# EAGLE schematic Receiver SMD (EAGLE 6.4)
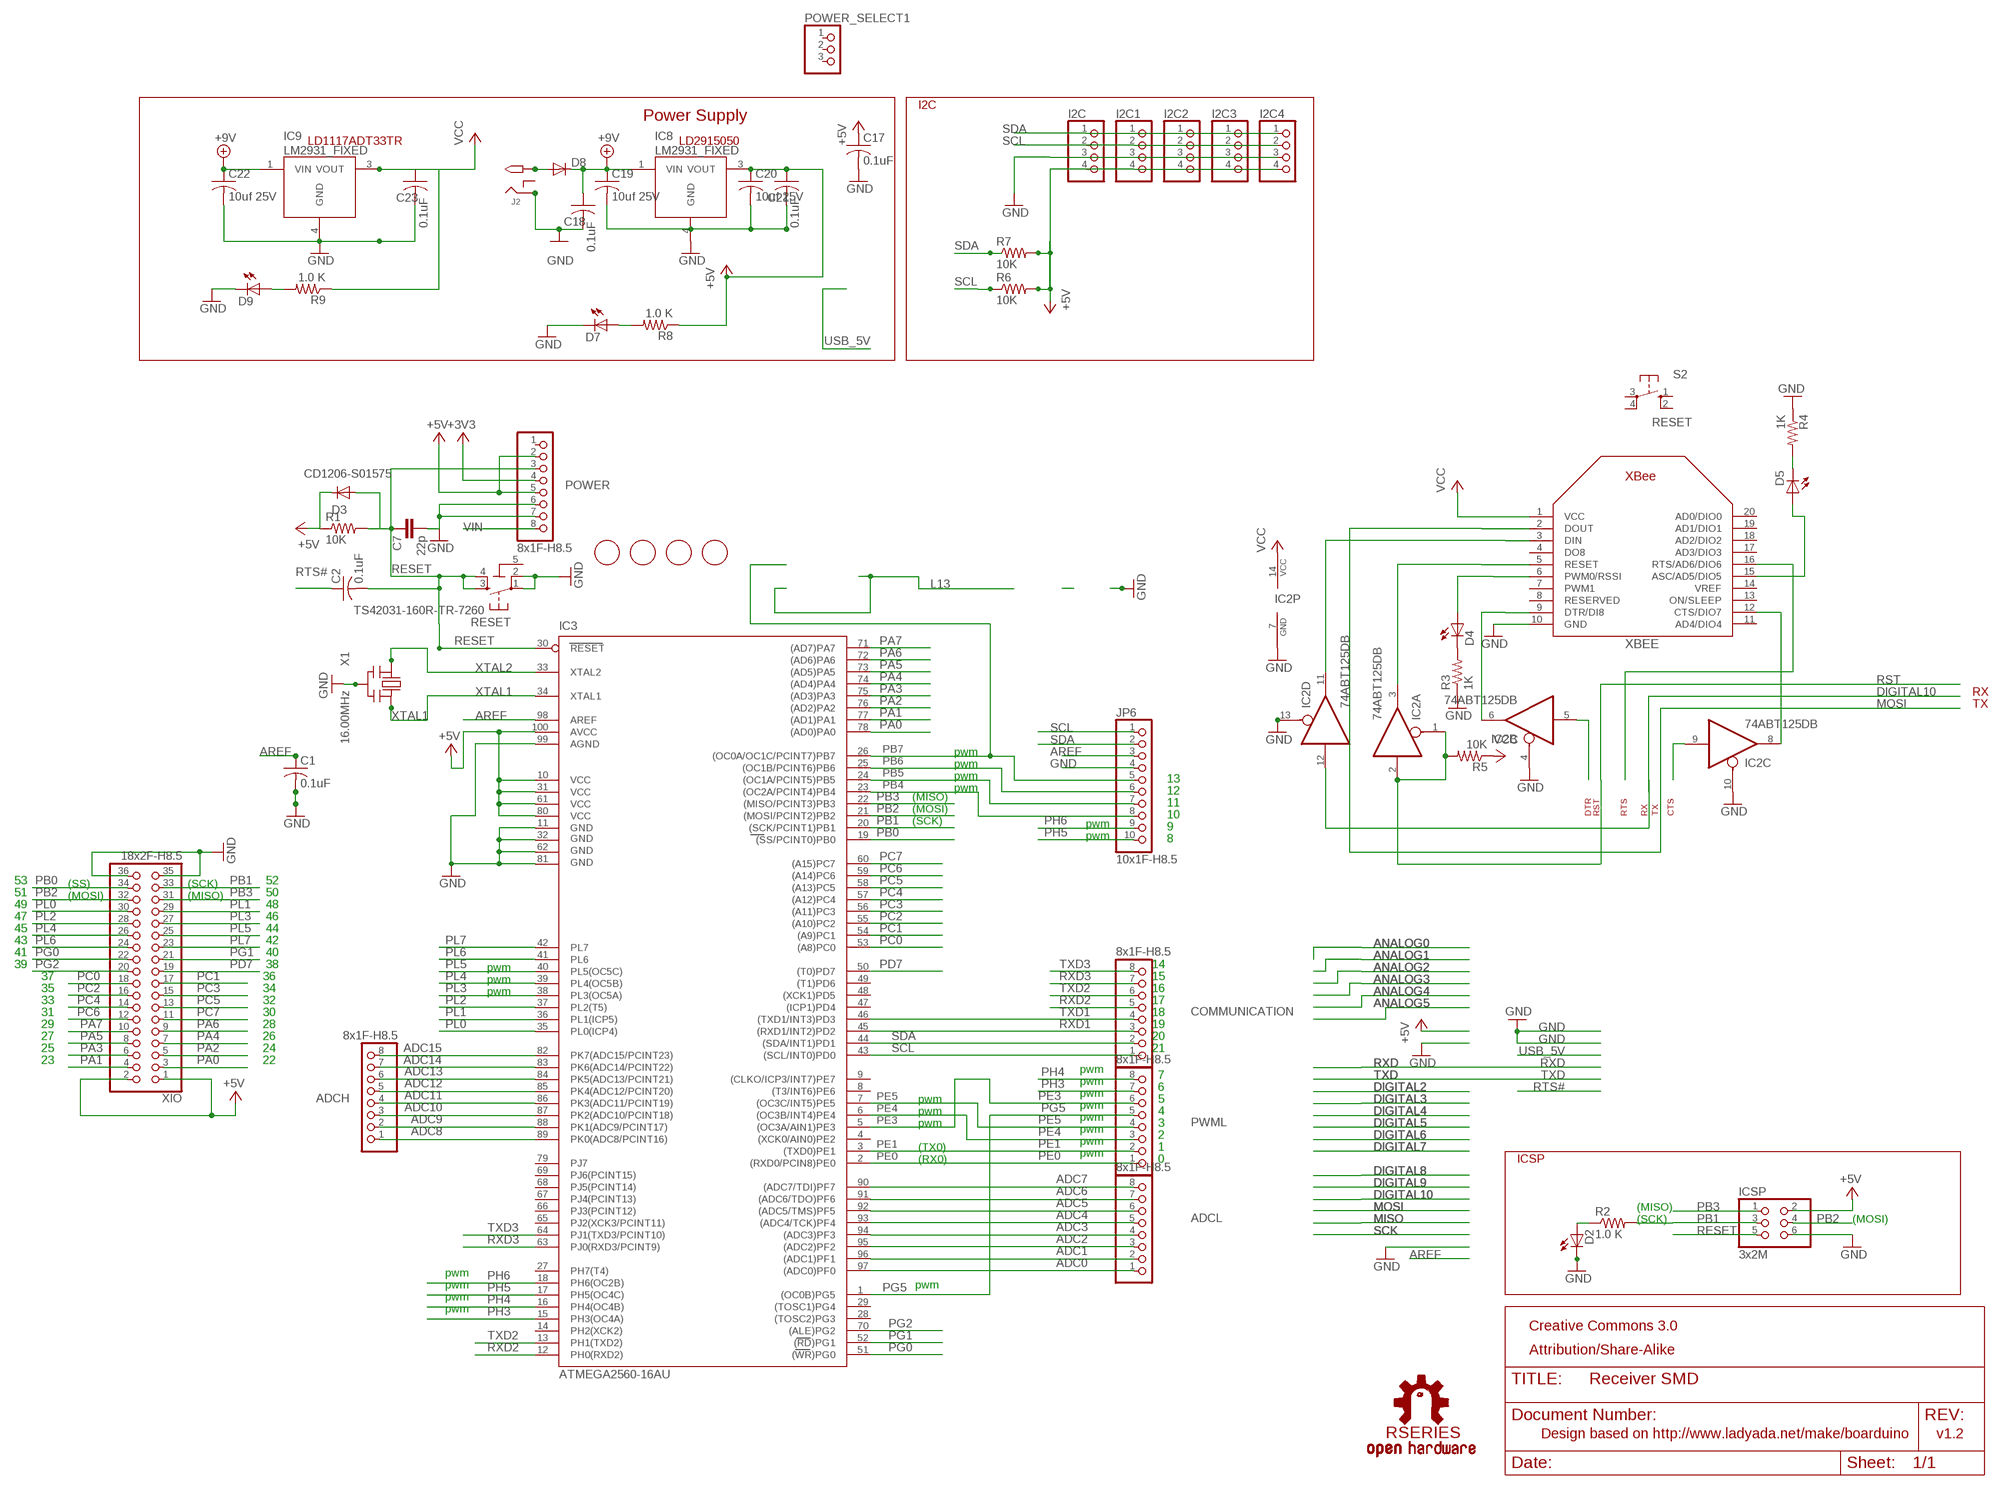
[diagram p0: schematic, sheet 1]

## Parts
ADCH  8x1F-H8.5  PINHD-1X8  [1X08]
ADCL  8x1F-H8.5  PINHD-1X8  [1X08]
C1  0.1uF  C-USC1206K  [C1206K]
C2  0.1uF  C-USC1206K  [C1206K]
C7  22p  C-EU0603-RND  [C0603-ROUND]
C17  0.1uF  C-USC1206K  [C1206K]
C18  0.1uF  C-USC1206K  [C1206K]
C19  10uf 25V  C-USC1206K  [C1206K]
C20  10uf 25V  C-USC1206K  [C1206K]
C21  0.1uF  C-USC1206K  [C1206K]
C22  10uf 25V  C-USC1206K  [C1206K]
C23  0.1uF  C-USC1206K  [C1206K]
COMMUNICATION  8x1F-H8.5  PINHD-1X8  [1X08]
D2  RED  LEDCHIPLED_1206  [CHIPLED_1206]
D3  CD1206-S01575  DIODE-MINIMELF  [MINIMELF]
D4  LEDCHIPLED_1206  [CHIPLED_1206]
D5  LEDCHIPLED_1206  [CHIPLED_1206]
D7  LEDCHIPLED_1206  [CHIPLED_1206]
D8  DIODE-SMB  [SMB]
D9  LEDCHIPLED_1206  [CHIPLED_1206]
FD1  FIDUCIALMOUNT  [FIDUCIA-MOUNT]
FD2  FIDUCIALMOUNT  [FIDUCIA-MOUNT]
FD3  FIDUCIALMOUNT  [FIDUCIA-MOUNT]
FD4  FIDUCIALMOUNT  [FIDUCIA-MOUNT]
I2C  PINHD-1X4CB  [1X04-CB]
I2C1  PINHD-1X4CB  [1X04-CB]
I2C2  PINHD-1X4CB  [1X04-CB]
I2C3  PINHD-1X4CB  [1X04-CB]
I2C4  PINHD-1X4CB  [1X04-CB]
IC2  74ABT125DB  [SSOP14]
IC3  ATMEGA2560-16AU  ATMEGA25602560-16AU  [TQFP100]
IC8  LM2931_FIXED  [DPAK]
IC9  LM2931_FIXED  [DPAK]
ICSP  3x2M  PINHD-2X3  [2X03]
J2  2.1MMJACK  [PJ-102A]
JP6  10x1F-H8.5  PINHD-1X10_ARD  [1X10]
POWER  8x1F-H8.5  PINHD-1X8  [1X08]
POWER_SELECT1  PINHD-1X3  [1X03]
PWML  8x1F-H8.5  PINHD-1X8  [1X08]
R1  10K  R-US_R1206  [R1206]
R2  1.0 K  R-US_M1206  [M1206]
R3  1K  R-US_R1206  [R1206]
R4  1K  R-US_R1206  [R1206]
R5  10K  R-US_R1206  [R1206]
R6  10K  R-US_R1206  [R1206]
R7  10K  R-US_R1206  [R1206]
R8  1.0 K  R-US_M1206  [M1206]
R9  1.0 K  R-US_M1206  [M1206]
RESET  TS42031-160R-TR-7260  TS42  [TS42]
S2  RESET  10-XX  [B3F-10XX]
U$6  RSERIES-OSHW-LOGOMEDIUM  [RSERIES-OSHW-LOGO-MEDIUM]
X1  16.00MHz  CERMOSCILL  [CERM_OSC]
XBEE  XBEE  [XBEE]
XIO  18x2F-H8.5  PINHD-2X18  [2X18]

## Nets
+3V3 [supply]: POWER.4
+5V [power usb]: C17.1 C20.1 C21.1 D3.C I2C1.4 I2C2.4 I2C3.4 I2C4.4 I2C.4 IC3.10(VCC) IC3.31(VCC1) IC3.61(VCC2) IC3.80(VCC3) IC3.100(AVCC) IC8.3(VOUT) ICSP.2 POWER.2 POWER.5 R1.1 R6.2 R7.2 R8.1 XIO.1 XIO.2
+9V [supply]: C18.1 C19.1 C22.1 D8.C IC8.1(VIN) IC9.1(VIN)
ADC0: ADCL.1 IC3.97((ADC0)PF0)
ADC1: ADCL.2 IC3.96((ADC1)PF1)
ADC2: ADCL.3 IC3.95((ADC2)PF2)
ADC3: ADCL.4 IC3.94((ADC3)PF3)
ADC4: ADCL.5 IC3.93((ADC4/TCK)PF4)
ADC5: ADCL.6 IC3.92((ADC5/TMS)PF5)
ADC6: ADCL.7 IC3.91((ADC6/TDO)PF6)
ADC7: ADCL.8 IC3.90((ADC7/TDI)PF7)
ADC8: ADCH.1 IC3.89(PK0(ADC8/PCINT16))
ADC9: ADCH.2 IC3.88(PK1(ADC9/PCINT17))
ADC10: ADCH.3 IC3.87(PK2(ADC10/PCINT18))
ADC11: ADCH.4 IC3.86(PK3(ADC11/PCINT19))
ADC12: ADCH.5 IC3.85(PK4(ADC12/PCINT20))
ADC13: ADCH.6 IC3.84(PK5(ADC13/PCINT21))
ADC14: ADCH.7 IC3.83(PK6(ADC14/PCINT22))
ADC15: ADCH.8 IC3.82(PK7(ADC15/PCINT23))
AREF: C1.1 IC3.98(AREF) JP6.3
DIGITAL10: IC2.12(D:I)
GND [GND]: C1.2 C7.2 C17.2 C18.2 C22.2 C23.2 D2.C D7.C D9.C I2C1.3 I2C2.3 I2C3.3 I2C4.3 I2C.3 IC2.4(B:OE) IC2.7(P:GND) IC2.10(C:OE) IC2.13(D:OE) IC3.11(GND) IC3.32(GND1) IC3.62(GND2) IC3.81(GND3) IC3.99(AGND) IC8.4(GND) IC9.4(GND) ICSP.6 J2.RING JP6.4 POWER.6 POWER.7 R3.1 R4.1 RESET.1 RESET.2 X1.P$2(GND) XBEE.10(GND) XIO.35 XIO.36
MOSI: XBEE.2(DOUT)
N$4: IC2.11(D:O) XBEE.3(DIN)
N$5: D5.C R4.2
N$6: IC2.5(B:I)
N$7: D4.A XBEE.6(PWM0/RSSI)
N$8: D4.C R3.2
N$9: D9.A R9.2
N$10: IC2.6(B:O) XBEE.9(DTR/DI8)
N$11: D2.A R2.1
N$13: IC2.3(A:O) XBEE.5(RESET)
N$21: IC2.9(C:I)
N$22: IC2.8(C:O) XBEE.12(CTS/DIO7)
N$23: D5.A XBEE.15(ASC/AD5/DIO5)
N$28 [supply]: D7.A R8.2
N$29 [supply]: D8.A J2.TIP
N$30: C19.2 C20.2 C21.2
PA0: IC3.78((AD0)PA0) XIO.3
PA1: IC3.77((AD1)PA1) XIO.4
PA2: IC3.76((AD2)PA2) XIO.5
PA3: IC3.75((AD3)PA3) XIO.6
PA4: IC3.74((AD4)PA4) XIO.7
PA5: IC3.73((AD5)PA5) XIO.8
PA6: IC3.72((AD6)PA6) XIO.9
PA7: IC3.71((AD7)PA7) XIO.10
PB0: IC3.19((SS/PCINT0)PB0) XIO.34
PB1: IC3.20((SCK/PCINT1)PB1) ICSP.3 R2.2 XIO.33
PB2: IC3.21((MOSI/PCINT2)PB2) ICSP.4 XIO.32
PB3: IC3.22((MISO/PCINT3)PB3) ICSP.1 XIO.31
PB4: IC3.23((OC2A/PCINT4)PB4) JP6.8
PB5: IC3.24((OC1A/PCINT5)PB5) JP6.7
PB6: IC3.25((OC1B/PCINT6)PB6) JP6.6
PB7: IC3.26((OC0A/OC1C/PCINT7)PB7) JP6.5
PC0: IC3.53((A8)PC0) XIO.18
PC1: IC3.54((A9)PC1) XIO.17
PC2: IC3.55((A10)PC2) XIO.16
PC3: IC3.56((A11)PC3) XIO.15
PC4: IC3.57((A12)PC4) XIO.14
PC5: IC3.58((A13)PC5) XIO.13
PC6: IC3.59((A14)PC6) XIO.12
PC7: IC3.60((A15)PC7) XIO.11
PD7: IC3.50((T0)PD7) XIO.19
PE0: IC3.2((RXD0/PCIN8)PE0) PWML.1
PE1: IC3.3((TXD0)PE1) PWML.2
PE3: IC3.5((OC3A/AIN1)PE3) PWML.6
PE4: IC3.6((OC3B/INT4)PE4) PWML.3
PE5: IC3.7((OC3C/INT5)PE5) PWML.4
PG0: IC3.51((WR)PG0) XIO.22
PG1: IC3.52((RD)PG1) XIO.21
PG2: IC3.70((ALE)PG2) XIO.20
PG5: IC3.1((OC0B)PG5) PWML.5
PH3: IC3.15(PH3(OC4A)) PWML.7
PH4: IC3.16(PH4(OC4B)) PWML.8
PH5: IC3.17(PH5(OC4C)) JP6.10
PH6: IC3.18(PH6(OC2B)) JP6.9
PL0: IC3.35(PL0(ICP4)) XIO.30
PL1: IC3.36(PL1(ICP5)) XIO.29
PL2: IC3.37(PL2(T5)) XIO.28
PL3: IC3.38(PL3(OC5A)) XIO.27
PL4: IC3.39(PL4(OC5B)) XIO.26
PL5: IC3.40(PL5(OC5C)) XIO.25
PL6: IC3.41(PL6) XIO.24
PL7: IC3.42(PL7) XIO.23
RESET: C2.2 C7.1 D3.A IC3.30(RESET) ICSP.5 POWER.3 R1.2 RESET.3 RESET.4
RST: IC2.1(A:OE) IC2.2(A:I) R5.2
RTS: XBEE.16(RTS/AD6/DIO6)
RTS#: C2.1
RXD1: COMMUNICATION.3 IC3.45((RXD1/INT2)PD2)
RXD2: COMMUNICATION.5 IC3.12(PH0(RXD2))
RXD3: COMMUNICATION.7 IC3.63(PJ0(RXD3/PCINT9))
SCL: COMMUNICATION.1 I2C1.2 I2C2.2 I2C3.2 I2C4.2 I2C.2 IC3.43((SCL/INT0)PD0) JP6.1 R6.1
SDA: COMMUNICATION.2 I2C1.1 I2C2.1 I2C3.1 I2C4.1 I2C.1 IC3.44((SDA/INT1)PD1) JP6.2 R7.1
TXD1: COMMUNICATION.4 IC3.46((TXD1/INT3)PD3)
TXD2: COMMUNICATION.6 IC3.13(PH1(TXD2))
TXD3: COMMUNICATION.8 IC3.64(PJ1(TXD3/PCINT10))
VCC [supply]: C23.1 IC2.14(P:VCC) IC9.3(VOUT) R5.1 R9.1 XBEE.1(VCC)
VIN [supply]: POWER.8
XTAL1: IC3.34(XTAL1) X1.P$3(OUT)
XTAL2: IC3.33(XTAL2) X1.P$1(IN)
Unconnected: IC3.4((XCK0/AIN0)PE2) IC3.8((T3/INT6)PE6) IC3.9((CLKO/ICP3/INT7)PE7) IC3.14(PH2(XCK2)) IC3.27(PH7(T4)) IC3.28((TOSC2)PG3) IC3.29((TOSC1)PG4) IC3.47((ICP1)PD4) IC3.48((XCK1)PD5) IC3.49((T1)PD6) IC3.65(PJ2(XCK3/PCINT11)) IC3.66(PJ3(PCINT12)) IC3.67(PJ4(PCINT13)) IC3.68(PJ5(PCINT14)) IC3.69(PJ6(PCINT15)) IC3.79(PJ7) J2.RING_SW POWER.1 POWER_SELECT1.1 POWER_SELECT1.2 POWER_SELECT1.3 S2.1(S) S2.2(S1) S2.3(P) S2.4(P1) XBEE.4(DO8) XBEE.7(PWM1) XBEE.8(RESERVED) XBEE.11(AD4/DIO4) XBEE.13(ON/SLEEP) XBEE.14(VREF) XBEE.17(AD3/DIO3) XBEE.18(AD2/DIO2) XBEE.19(AD1/DIO1) XBEE.20(AD0/DIO0)

## Notes on the sheet
- I2C
- Power Supply
- LD1117ADT33TR | LD2915050
- RX
- TX
- pwm
- pwm
- pwm | 13
- pwm | 12
- (MISO)
- 11
- (MOSI)
- DTR | RST | RTS | RX | TX | CTS
- 10
- (SCK) | pwm
- 9
- pwm | 8
- 53 | (SS) | (SCK) | 52
- 51 | (MOSI) | (MISO) | 50
- 49 | 48
- 47 | 46
- 45 | 44
- 43 | 42
- 41 | 40
- 39 | 38 | pwm | 14
- 37 | 36 | pwm | 15
- 35 | 34 | pwm | 16
- 33 | 32 | 17
- 31 | 30 | 18
- 29 | 28 | 19
- 27 | 26 | 20
- 25 | 24 | 21
- 23 | 22
- pwm
- 7
- pwm
- 6
- pwm
- pwm | 5
- pwm
- pwm | 4
- pwm
- pwm | 3
- pwm
- 2
- pwm
- (TX0) | 1
- pwm
- (RX0) | 0 | ICSP
- (MISO)
- (SCK) | (MOSI)
- pwm
- pwm | pwm
- pwm
- pwm
- Creative Commons 3.0
- Attribution/Share-Alike
- Design based on http://www.ladyada.net/make/boarduino | v1.2

## Power pins joined to a net without a drawn wire
5-GND: RESET.5(5-GND)

## Library data of the parts
ADCH ADCL COMMUNICATION POWER PWML = SmartPrj:PINHD-1X8: PIN HEADER
C1 C2 C17 C18 C21 C23 = minimidi:C-US: CAPACITOR, American symbol
C7 = SmartPrj:C-EU: CAPACITOR, European symbol
C19 C20 C22 = rcl:C-US: CAPACITOR, American symbol
D2 D4 D5 D7 D9 = minimidi:LED: LED OSRAM: - CHIPLED LG R971, LG N971, LY N971, LG Q971, LY Q971, LO R971, LY R971 LH N974, LH R974 LS Q976, LO Q976, LY Q976 LO Q996 - Hyper CHIPLED LW Q18S LB Q993, LB Q99A, LB R99A - SideLED LS A670, LO A670, LY A670, LG A670, LP A670 LB A673, LV A673, LT A673, LW A673 LH A674 LY A675 LS A676, LA A676, LO A676, LY A676, LW A676 LS A679, LY A679, LG A679 - Hyper Micro SIDELED® LS Y876, LA Y876, LO Y876, LY Y876 LT Y87S - SmartLED LW L88C, LW L88S LB L89C, LB L89S, LG L890 LS L89K, LO L89K, LY L89K LS L896, LA L896, LO L896, LY L896 - TOPLED LS T670, LO T670, LY T670, LG T670, LP T670 LSG T670, LSP T670, LSY T670, LOP T670, LYG T670 LG T671, LOG T671, LSG T671 LB T673, LV T673, LT T673, LW T673 LH T674 LS T676, LA T676, LO T676, LY T676, LB T676, LH T676, LSB T676, LW T676 LB T67C, LV T67C, LT T67C, LS T67K, LO T67K, LY T67K, LW E67C LS E67B, LA E67B, LO E67B, LY E67B, LB E67C, LV E67C, LT E67C LW T67C LS T679, LY T679, LG T679 LS T770, LO T770, LY T770, LG T770, LP T770 LB T773, LV T773, LT T773, LW T773 LH T774 LS E675, LA E675, LY E675, LS T675 LS T776, LA T776, LO T776, LY T776, LB T776 LHGB T686 LT T68C, LB T68C - Hyper Mini TOPLED® LB M676 - Mini TOPLED Santana® LG M470 LS M47K, LO M47K, LY M47K Source: http://www.osram.convergy.de/
D3 D8 = diode:DIODE-: DIODE
FD1-FD4 = SmartPrj:FIDUCIALMOUNT
I2C I2C1-I2C4 = carduino:PINHD-1X4: PIN HEADER
IC2 = 74xx-us:74*125: Quad bus BUFFER, 3-state
IC3 = SmartPrj:ATMEGA2560: MICROCONTROLLER 64/128/256 Kbytes FLASH 4 Kbytes EEPROM 8 Kbytes SRAM 86 General Purpose I/O pins 12-channels16-bit PWM 4 x Serial USARTs 16-channels 10-bit A/D
IC8 IC9 = SparkFun-PowerIC:LM2931_FIXED: LDO regulator with reverse battery protection- very durable!
ICSP = SmartPrj:PINHD-2X3: PIN HEADER
J2 = minimidi:2.1MMJACK
JP6 = SmartPrj:PINHD-1X10_ARD: PIN HEADER
POWER_SELECT1 = pinhead:PINHD-1X3: PIN HEADER
R1 R3-R7 = rcl-ez:R-US_: RESISTOR, American symbol
R2 R8 R9 = minimidi:R-US_: RESISTOR, American symbol
RESET = SmartPrj:TS42: TS42 Dongnan Electronics Tact switch VDC 12V - 50mA
S2 = switch-omron:10-XX: OMRON SWITCH
U$6 = rseries:RSERIES-OSHW-LOGO
X1 = digg:CERMOSCILL
XBEE = ulink:XBEE
XIO = SmartPrj:PINHD-2X18: PIN HEADER

## Net classes
0 default: width 0.203 mm, drill 0.406 mm, clearance 0.203 mm
1 supply: width 0.381 mm, drill 0.152 mm, clearance 0.152 mm
2 GND: width 0.381 mm, drill 0.305 mm, clearance 0.152 mm
3 power usb: width 0.508 mm, drill 0.406 mm, clearance 0.203 mm